# Altium schematic sheet main.SCHDOC
size B
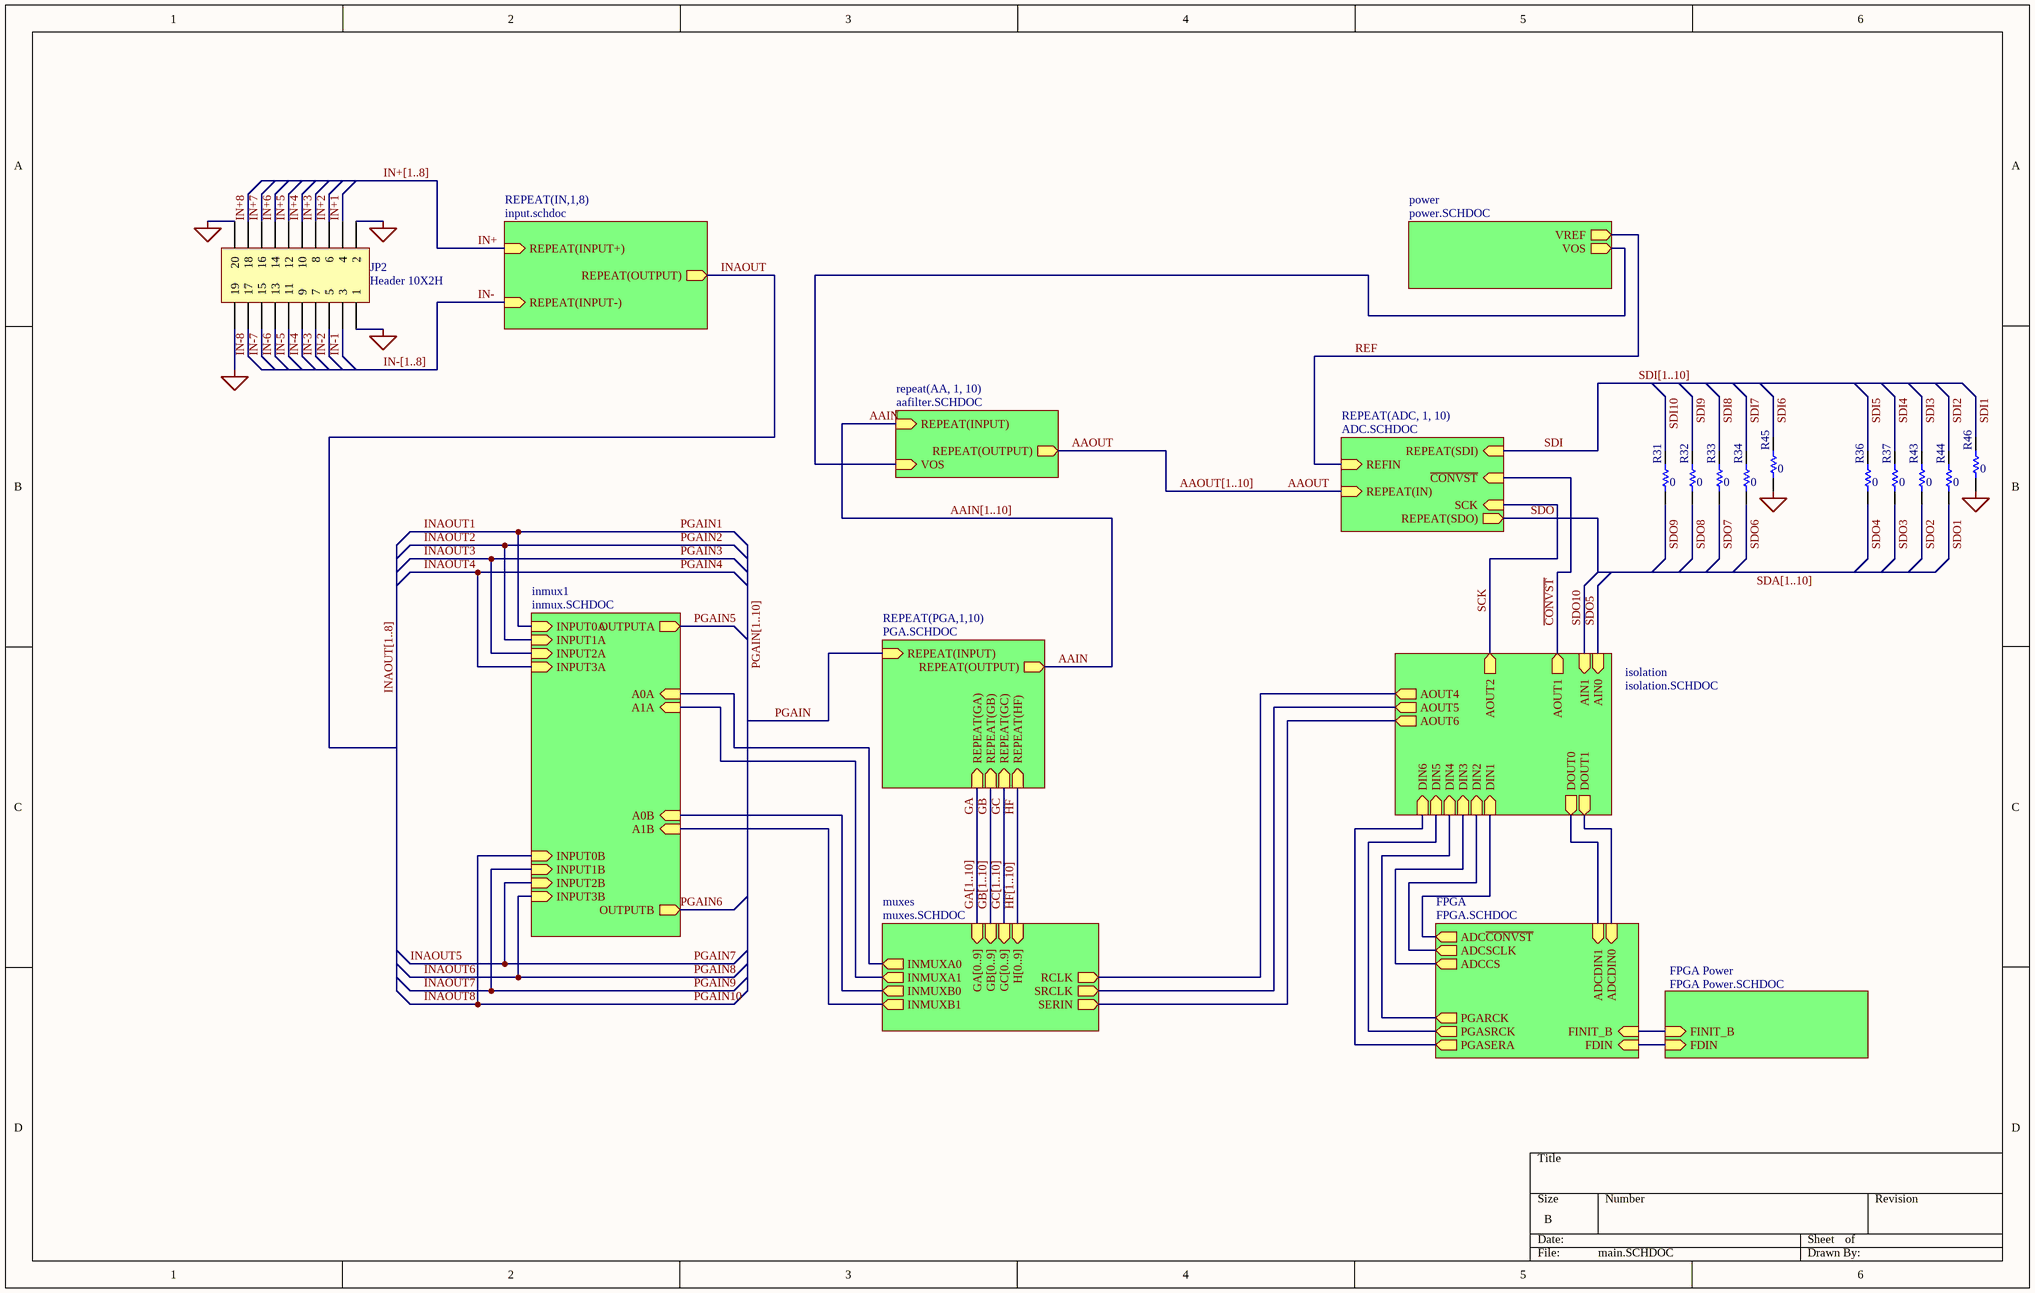
[diagram p0: main.SCHDOC]

## Parts
JP2  Header 10X2H  [HDR2X10]
R31  value 0  [0603]  (hidden comment: Res1)
R32  value 0  [0603]  (hidden comment: Res1)
R33  value 0  [0603]  (hidden comment: Res1)
R34  value 0  [0603]  (hidden comment: Res1)
R36  value 0  [0603]  (hidden comment: Res1)
R37  value 0  [0603]  (hidden comment: Res1)
R43  value 0  [0603]  (hidden comment: Res1)
R44  value 0  [0603]  (hidden comment: Res1)
R45  value 0  [0603]  (hidden comment: Res1)
R46  value 0  [0603]  (hidden comment: Res1)

## Sub-sheets
FPGA = FPGA.SCHDOC: ADCDIN0 (in), ADCDIN1 (in), ADCSCLK (out), ADCCS (out), ADC~{CONVST} (out), PGARCK (out), PGASRCK (out), PGASERA (out), FINIT_B (in), FDIN (in)
FPGA Power = FPGA Power.SCHDOC: FINIT_B (in), FDIN (in)
inmux1 = inmux.SCHDOC: INPUT0A (in), INPUT1A (in), INPUT2A (in), INPUT3A (in), A0A (in), A1A (in), OUTPUTA (out), INPUT0B (in), INPUT1B (in), INPUT2B (in), INPUT3B, A0B (in), A1B (in), OUTPUTB (out)
isolation = isolation.SCHDOC: AIN1 (in), AIN0 (in), DOUT1 (out), DOUT0 (out), AOUT1 (out), AOUT2 (out), AOUT4, AOUT5 (out), AOUT6 (out), DIN1 (in), DIN2 (in), DIN3 (in), DIN4 (in), DIN5 (in), DIN6 (in)
muxes = muxes.SCHDOC: RCLK (out), SRCLK (out), SERIN (out), INMUXA0 (out), INMUXA1 (out), INMUXB0 (out), INMUXB1 (out), H[0..9] (in), GA[0..9] (in), GB[0..9] (in), GC[0..9] (in)
power = power.SCHDOC: VREF (out), VOS (out)
repeat(AA, 1, 10) = aafilter.SCHDOC: REPEAT(OUTPUT) (out), REPEAT(INPUT) (in), VOS (in)
REPEAT(ADC, 1, 10) = ADC.SCHDOC: REFIN (in), REPEAT(IN) (in), ~{CONVST} (in), SCK (in), REPEAT(SDO) (out), REPEAT(SDI) (in)
REPEAT(IN,1,8) = input.schdoc: REPEAT(INPUT+) (in), REPEAT(INPUT-) (in), REPEAT(OUTPUT) (out)
REPEAT(PGA,1,10) = PGA.SCHDOC: REPEAT(OUTPUT) (out), REPEAT(INPUT) (in), REPEAT(HF) (in), REPEAT(GA) (in), REPEAT(GB) (in), REPEAT(GC) (in)

## Nets
AGND: JP2.1 JP2.2 JP2.19 JP2.20 R45.1 R46.1
AAIN: sheet repeat(AA, 1, 10)/REPEAT(INPUT), sheet REPEAT(PGA,1,10)/REPEAT(OUTPUT)
AAOUT: sheet repeat(AA, 1, 10)/REPEAT(OUTPUT), sheet REPEAT(ADC, 1, 10)/REPEAT(IN)
~{CONVST}: sheet isolation/AOUT1, sheet REPEAT(ADC, 1, 10)/~{CONVST}
GA: sheet REPEAT(PGA,1,10)/REPEAT(GA)
GB: sheet REPEAT(PGA,1,10)/REPEAT(GB)
GC: sheet REPEAT(PGA,1,10)/REPEAT(GC)
HF: sheet REPEAT(PGA,1,10)/REPEAT(HF)
IN+: sheet REPEAT(IN,1,8)/REPEAT(INPUT+)
IN+1: JP2.4
IN+2: JP2.6
IN+3: JP2.8
IN+4: JP2.10
IN+5: JP2.12
IN+6: JP2.14
IN+7: JP2.16
IN+8: JP2.18
IN-: sheet REPEAT(IN,1,8)/REPEAT(INPUT-)
IN-1: JP2.3
IN-2: JP2.5
IN-3: JP2.7
IN-4: JP2.9
IN-5: JP2.11
IN-6: JP2.13
IN-7: JP2.15
IN-8: JP2.17
INAOUT: sheet REPEAT(IN,1,8)/REPEAT(OUTPUT)
INAOUT1: sheet inmux1/INPUT0A  [also labelled PGAIN1]
INAOUT2: sheet inmux1/INPUT1A  [also labelled PGAIN2]
INAOUT3: sheet inmux1/INPUT2A  [also labelled PGAIN3]
INAOUT4: sheet inmux1/INPUT3A  [also labelled PGAIN4]
INAOUT5: sheet inmux1/INPUT2B  [also labelled PGAIN7]
INAOUT6: sheet inmux1/INPUT3B  [also labelled PGAIN8]
INAOUT7: sheet inmux1/INPUT1B  [also labelled PGAIN9]
INAOUT8: sheet inmux1/INPUT0B  [also labelled PGAIN10]
PGAIN: sheet REPEAT(PGA,1,10)/REPEAT(INPUT)
PGAIN5: sheet inmux1/OUTPUTA
PGAIN6: sheet inmux1/OUTPUTB
REF: sheet power/VREF, sheet REPEAT(ADC, 1, 10)/REFIN
SCK: sheet isolation/AOUT2, sheet REPEAT(ADC, 1, 10)/SCK
SDI: sheet REPEAT(ADC, 1, 10)/REPEAT(SDI)
SDI1: R46.2
SDI2: R44.2
SDI3: R43.2
SDI4: R37.2
SDI5: R36.2
SDI6: R45.2
SDI7: R34.2
SDI8: R33.2
SDI9: R32.2
SDI10: R31.2
SDO: sheet REPEAT(ADC, 1, 10)/REPEAT(SDO)
SDO1: R44.1
SDO2: R43.1
SDO3: R37.1
SDO4: R36.1
SDO5: sheet isolation/AIN0
SDO6: R34.1
SDO7: R33.1
SDO8: R32.1
SDO9: R31.1
SDO10: sheet isolation/AIN1
(unnamed): sheet repeat(AA, 1, 10)/VOS, sheet power/VOS
(unnamed): sheet inmux1/A0A, sheet muxes/INMUXA0
(unnamed): sheet inmux1/A1A, sheet muxes/INMUXA1
(unnamed): sheet inmux1/A0B, sheet muxes/INMUXB0
(unnamed): sheet inmux1/A1B, sheet muxes/INMUXB1
(unnamed): sheet isolation/DOUT1, sheet FPGA/ADCDIN0
(unnamed): sheet isolation/DOUT0, sheet FPGA/ADCDIN1
(unnamed): sheet isolation/AOUT4, sheet muxes/RCLK
(unnamed): sheet isolation/AOUT5, sheet muxes/SRCLK
(unnamed): sheet isolation/AOUT6, sheet muxes/SERIN
(unnamed): sheet isolation/DIN1, sheet FPGA/ADC~{CONVST}
(unnamed): sheet isolation/DIN2, sheet FPGA/ADCSCLK
(unnamed): sheet isolation/DIN3, sheet FPGA/ADCCS
(unnamed): sheet isolation/DIN4, sheet FPGA/PGARCK
(unnamed): sheet isolation/DIN5, sheet FPGA/PGASRCK
(unnamed): sheet isolation/DIN6, sheet FPGA/PGASERA
(unnamed): sheet FPGA/FINIT_B, sheet FPGA Power/FINIT_B
(unnamed): sheet FPGA/FDIN, sheet FPGA Power/FDIN

## Buses and harness runs
bus AAIN[1..10]
bus AAOUT[1..10]
bus GA[1..10] = sheet muxes/GA[0..9]
bus GB[1..10] = sheet muxes/GB[0..9]
bus GC[1..10] = sheet muxes/GC[0..9]
bus HF[1..10] = sheet muxes/H[0..9]
bus IN+[1..8]
bus IN-[1..8]
bus INAOUT[1..8]
bus PGAIN[1..10]
bus SDA[1..10]
bus SDI[1..10]

## Library data of the parts
JP2 = Header 10X2H: Header, 10-Pin, Dual row, Right Angle; Manufacturer: Generic Components; Class I: Connector; Revision: July-2002: Re-released for DXP Platform.; Publisher: Altium Limited
R31-R34 R36 R37 R43-R46 = Res1: Resistor; Published: 8-Jun-2000; LatestRevisionDate: 17-Jul-2002; LatestRevisionNote: Re-released for DXP Platform.; Publisher: Altium Limited